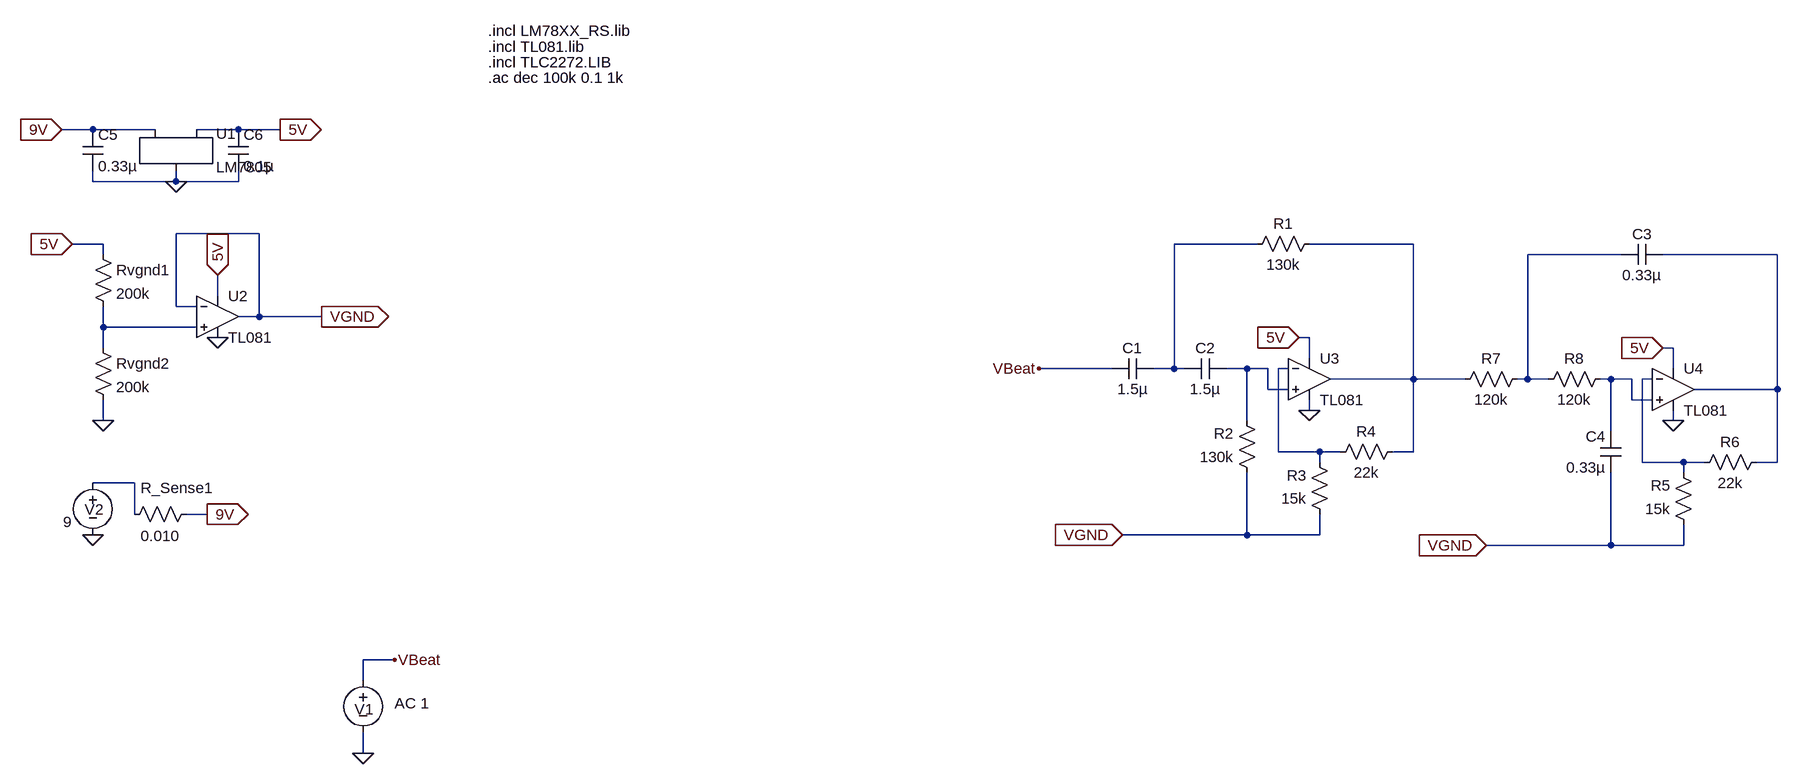
[diagram p0: schematic BPF.asc]
BPF.asc, the LTspice schematic file:
Version 4
SHEET 1 1836 680
WIRE -1088 -560 -1136 -560
WIRE -992 -560 -1088 -560
WIRE -864 -560 -928 -560
WIRE -800 -560 -864 -560
WIRE -1088 -480 -1088 -496
WIRE -960 -480 -960 -496
WIRE -960 -480 -1088 -480
WIRE -864 -480 -864 -496
WIRE -864 -480 -960 -480
WIRE -832 -400 -960 -400
WIRE -1072 -384 -1120 -384
WIRE 704 -384 576 -384
WIRE 944 -384 784 -384
WIRE -1072 -368 -1072 -384
WIRE 1264 -368 1120 -368
WIRE 1504 -368 1328 -368
WIRE -896 -304 -896 -336
WIRE -960 -288 -960 -400
WIRE -928 -288 -960 -288
WIRE -832 -272 -832 -400
WIRE -832 -272 -864 -272
WIRE -736 -272 -832 -272
WIRE -1072 -256 -1072 -288
WIRE -928 -256 -1072 -256
WIRE 784 -240 768 -240
WIRE -1072 -224 -1072 -256
WIRE 1344 -224 1328 -224
WIRE 784 -208 784 -240
WIRE 480 -192 368 -192
WIRE 576 -192 576 -384
WIRE 576 -192 544 -192
WIRE 592 -192 576 -192
WIRE 688 -192 656 -192
WIRE 720 -192 688 -192
WIRE 752 -192 736 -192
WIRE 1344 -192 1344 -224
WIRE 944 -176 944 -384
WIRE 944 -176 816 -176
WIRE 1024 -176 944 -176
WIRE 1120 -176 1120 -368
WIRE 1120 -176 1104 -176
WIRE 1152 -176 1120 -176
WIRE 1248 -176 1232 -176
WIRE 1280 -176 1248 -176
WIRE 1312 -176 1296 -176
WIRE 720 -160 720 -192
WIRE 752 -160 720 -160
WIRE 1504 -160 1504 -368
WIRE 1504 -160 1376 -160
WIRE 1280 -144 1280 -176
WIRE 1312 -144 1280 -144
WIRE 784 -128 784 -144
WIRE -1072 -112 -1072 -144
WIRE 688 -112 688 -192
WIRE 1344 -112 1344 -128
WIRE 1248 -96 1248 -176
WIRE 736 -64 736 -192
WIRE 800 -64 736 -64
WIRE 832 -64 800 -64
WIRE 944 -64 944 -176
WIRE 944 -64 912 -64
WIRE 800 -48 800 -64
WIRE 1296 -48 1296 -176
WIRE 1360 -48 1296 -48
WIRE 1392 -48 1360 -48
WIRE 1504 -48 1504 -160
WIRE 1504 -48 1472 -48
WIRE 1360 -32 1360 -48
WIRE -1024 -16 -1088 -16
WIRE -1024 32 -1024 -16
WIRE -912 32 -944 32
WIRE 688 64 688 -32
WIRE 688 64 496 64
WIRE 800 64 800 32
WIRE 800 64 688 64
WIRE 1248 80 1248 -32
WIRE 1248 80 1056 80
WIRE 1360 80 1360 48
WIRE 1360 80 1248 80
WIRE -624 256 -672 256
WIRE -672 288 -672 256
WIRE -672 400 -672 368
FLAG 784 -128 0
FLAG 768 -240 5V
IOPIN 768 -240 In
FLAG 496 64 VGND
IOPIN 496 64 In
FLAG 1344 -112 0
FLAG 1328 -224 5V
IOPIN 1328 -224 In
FLAG 1056 80 VGND
IOPIN 1056 80 In
FLAG -1136 -560 9V
IOPIN -1136 -560 In
FLAG -960 -480 0
FLAG -800 -560 5V
IOPIN -800 -560 Out
FLAG -736 -272 VGND
IOPIN -736 -272 Out
FLAG -1072 -112 0
FLAG -1120 -384 5V
IOPIN -1120 -384 In
FLAG -896 -240 0
FLAG -896 -336 5V
IOPIN -896 -336 In
FLAG -912 32 9V
IOPIN -912 32 Out
FLAG -1088 64 0
FLAG -672 400 0
FLAG -624 256 VBeat
FLAG 368 -192 VBeat
SYMBOL cap 544 -208 R90
WINDOW 0 0 32 VBottom 2
WINDOW 3 32 32 VTop 2
SYMATTR InstName C1
SYMATTR Value 1.5µ
SYMBOL cap 656 -208 R90
WINDOW 0 0 32 VBottom 2
WINDOW 3 32 32 VTop 2
SYMATTR InstName C2
SYMATTR Value 1.5µ
SYMBOL res 800 -400 R90
WINDOW 0 0 56 VBottom 2
WINDOW 3 32 56 VTop 2
SYMATTR InstName R1
SYMATTR Value 130k
SYMBOL res 704 -16 R180
WINDOW 0 36 76 Left 2
WINDOW 3 36 40 Left 2
SYMATTR InstName R2
SYMATTR Value 130k
SYMBOL res 816 48 R180
WINDOW 0 36 76 Left 2
WINDOW 3 36 40 Left 2
SYMATTR InstName R3
SYMATTR Value 15k
SYMBOL res 928 -80 R90
WINDOW 0 0 56 VBottom 2
WINDOW 3 32 56 VTop 2
SYMATTR InstName R4
SYMATTR Value 22k
SYMBOL Opamps\\opamp2 784 -240 R0
SYMATTR InstName U3
SYMATTR Value TL081
SYMBOL res 1376 64 R180
WINDOW 0 36 76 Left 2
WINDOW 3 36 40 Left 2
SYMATTR InstName R5
SYMATTR Value 15k
SYMBOL res 1488 -64 R90
WINDOW 0 0 56 VBottom 2
WINDOW 3 32 56 VTop 2
SYMATTR InstName R6
SYMATTR Value 22k
SYMBOL Opamps\\opamp2 1344 -224 R0
SYMATTR InstName U4
SYMATTR Value TL081
SYMBOL res 1120 -192 R90
WINDOW 0 0 56 VBottom 2
WINDOW 3 32 56 VTop 2
SYMATTR InstName R7
SYMATTR Value 120k
SYMBOL res 1248 -192 R90
WINDOW 0 0 56 VBottom 2
WINDOW 3 32 56 VTop 2
SYMATTR InstName R8
SYMATTR Value 120k
SYMBOL cap 1328 -384 R90
WINDOW 0 0 32 VBottom 2
WINDOW 3 32 32 VTop 2
SYMATTR InstName C3
SYMATTR Value 0.33µ
SYMBOL cap 1264 -32 R180
WINDOW 0 24 56 Left 2
WINDOW 3 24 8 Left 2
SYMATTR InstName C4
SYMATTR Value 0.33µ
SYMBOL LM7805 -960 -544 R0
SYMATTR InstName U1
SYMBOL cap -1104 -560 R0
SYMATTR InstName C5
SYMATTR Value 0.33µ
SYMBOL cap -880 -560 R0
SYMATTR InstName C6
SYMATTR Value 0.1µ
SYMBOL res -1088 -384 R0
SYMATTR InstName Rvgnd1
SYMATTR Value 200k
SYMBOL res -1088 -240 R0
SYMATTR InstName Rvgnd2
SYMATTR Value 200k
SYMBOL Opamps\\opamp2 -896 -336 R0
SYMATTR InstName U2
SYMATTR Value TL081
SYMBOL voltage -672 272 R0
WINDOW 123 48 51 Left 2
WINDOW 39 0 0 Left 0
WINDOW 3 -89 253 Left 2
WINDOW 0 -13 60 Left 2
SYMATTR Value2 AC 1
SYMATTR Value ""
SYMATTR InstName V1
SYMBOL voltage -1088 -32 R0
WINDOW 123 24 44 Left 2
WINDOW 39 0 0 Left 0
WINDOW 3 -46 76 Left 2
WINDOW 0 -13 57 Left 2
SYMATTR Value 9
SYMATTR InstName V2
SYMBOL res -928 16 R90
WINDOW 0 -9 30 VBottom 2
WINDOW 3 34 56 VTop 2
SYMATTR InstName R_Sense1
SYMATTR Value 0.010
TEXT -480 -712 Left 2 !.incl LM78XX_RS.lib
TEXT -480 -688 Left 2 !.incl TL081.lib
TEXT -480 -664 Left 2 !.incl TLC2272.LIB
TEXT -480 -640 Left 2 !.ac dec 100k 0.1 1k

The netlist it stands for:
* BPF.asc
C1 N001 VBeat 1.5µ
C2 N006 N001 1.5µ
R1 N002 N001 130k
R2 VGND N006 130k
R3 VGND N007 15k
R4 N002 N007 22k
XU3 N006 N007 5V 0 N002 TL081  ; pins In+ In- V+ V- OUT
R5 VGND N009 15k
R6 N004 N009 22k
XU4 N008 N009 5V 0 N004 TL081  ; pins In+ In- V+ V- OUT
R7 N003 N002 120k
R8 N008 N003 120k
C3 N004 N003 0.33µ
C4 VGND N008 0.33µ
XU1 9V 0 5V LM7805
C5 9V 0 0.33µ
C6 5V 0 0.1µ
Rvgnd1 5V N005 200k
Rvgnd2 N005 0 200k
XU2 N005 VGND 5V 0 VGND TL081  ; pins In+ In- V+ V- OUT
V1 VBeat 0 AC 1
V2 N010 0 9
R_Sense1 9V N010 0.010
.incl LM78XX_RS.lib
.incl TL081.lib
.incl TLC2272.LIB
.ac dec 100k 0.1 1k
.backanno
.end